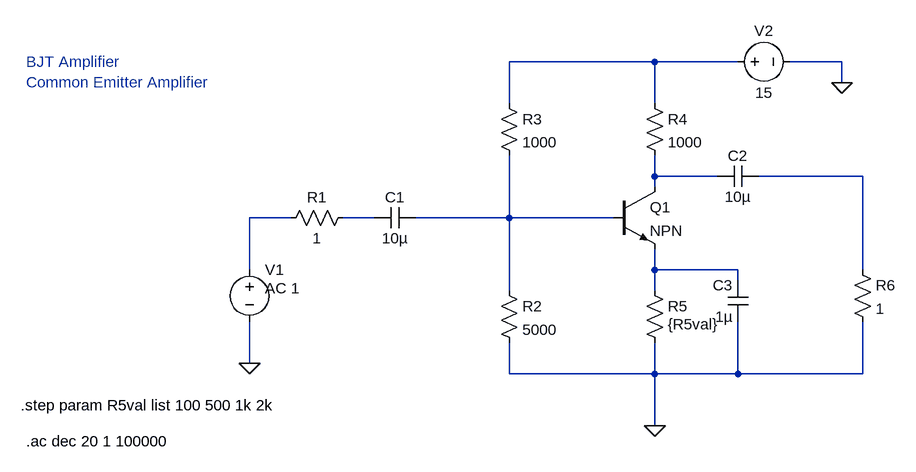
[diagram p0: schematic CommonEmiterAmplifier.asc]
CommonEmiterAmplifier.asc, the LTspice schematic file:
Version 4.1
SHEET 1 1076 680
WIRE 656 -176 432 -176
WIRE 784 -176 656 -176
WIRE 944 -176 864 -176
WIRE 944 -144 944 -176
WIRE 432 -112 432 -176
WIRE 656 -112 656 -176
WIRE 656 0 656 -32
WIRE 752 0 656 0
WIRE 976 0 816 0
WIRE 656 16 656 0
WIRE 96 64 32 64
WIRE 224 64 176 64
WIRE 432 64 432 -32
WIRE 432 64 288 64
WIRE 592 64 432 64
WIRE 32 144 32 64
WIRE 656 144 656 112
WIRE 784 144 656 144
WIRE 976 144 976 0
WIRE 784 160 784 144
WIRE 432 176 432 64
WIRE 656 176 656 144
WIRE 32 288 32 224
WIRE 432 304 432 256
WIRE 656 304 656 256
WIRE 656 304 432 304
WIRE 784 304 784 224
WIRE 784 304 656 304
WIRE 976 304 976 224
WIRE 976 304 784 304
WIRE 656 384 656 304
FLAG 32 288 0
FLAG 944 -144 0
FLAG 656 384 0
SYMBOL voltage 32 128 R0
WINDOW 123 24 44 Left 2
WINDOW 39 0 0 Left 0
SYMATTR Value2 AC 1
SYMATTR InstName V1
SYMATTR Value ""
SYMBOL res 192 48 R90
WINDOW 0 0 56 VBottom 2
WINDOW 3 32 56 VTop 2
SYMATTR InstName R1
SYMATTR Value 1
SYMBOL cap 288 48 R90
WINDOW 0 0 32 VBottom 2
WINDOW 3 32 32 VTop 2
SYMATTR InstName C1
SYMATTR Value 10µ
SYMBOL res 416 160 R0
SYMATTR InstName R2
SYMATTR Value 5000
SYMBOL res 416 -128 R0
SYMATTR InstName R3
SYMATTR Value 1000
SYMBOL res 640 -128 R0
SYMATTR InstName R4
SYMATTR Value 1000
SYMBOL res 640 160 R0
WINDOW 3 36 68 Left 2
SYMATTR InstName R5
SYMATTR Value {R5val}
SYMBOL res 960 128 R0
SYMATTR InstName R6
SYMATTR Value 1
SYMBOL cap 816 -16 R90
WINDOW 0 0 32 VBottom 2
WINDOW 3 32 32 VTop 2
SYMATTR InstName C2
SYMATTR Value 10µ
SYMBOL cap 800 224 R180
WINDOW 0 24 56 Left 2
WINDOW 3 24 8 Left 2
SYMATTR InstName C3
SYMATTR Value 1µ
SYMBOL npn 592 16 R0
SYMATTR InstName Q1
SYMBOL voltage 768 -176 R270
WINDOW 0 32 56 VTop 2
WINDOW 3 -32 56 VBottom 2
WINDOW 123 0 0 Left 0
WINDOW 39 0 0 Left 0
SYMATTR InstName V2
SYMATTR Value 15
TEXT -312 -176 Left 2 ;BJT Amplifier\nCommon Emitter Amplifier
TEXT -312 408 Left 2 !.ac dec 20 1 100000
TEXT -320 352 Left 2 !.step param R5val list 100 500 1k 2k

The netlist it stands for:
* CommonEmiterAmplifier.asc
V1 N004 0 AC 1
R1 N005 N004 1
C1 N006 N005 10µ
R2 N006 0 5000
R3 N001 N006 1000
R4 N001 N002 1000
R5 N007 0 {R5val}
R6 N003 0 1
C2 N003 N002 10µ
C3 0 N007 1µ
Q1 N002 N006 N007 0 NPN
V2 N001 0 15
.model NPN NPN
.model PNP PNP
.lib standard.bjt
* BJT Amplifier
* Common Emitter Amplifier
.ac dec 20 1 100000
.step param R5val list 100 500 1k 2k
.backanno
.end